# Altium schematic sheet ADC_AD9208.SchDoc
size A3; DocumentNumber: 1; SheetNumber: 1; SheetTotal: 5
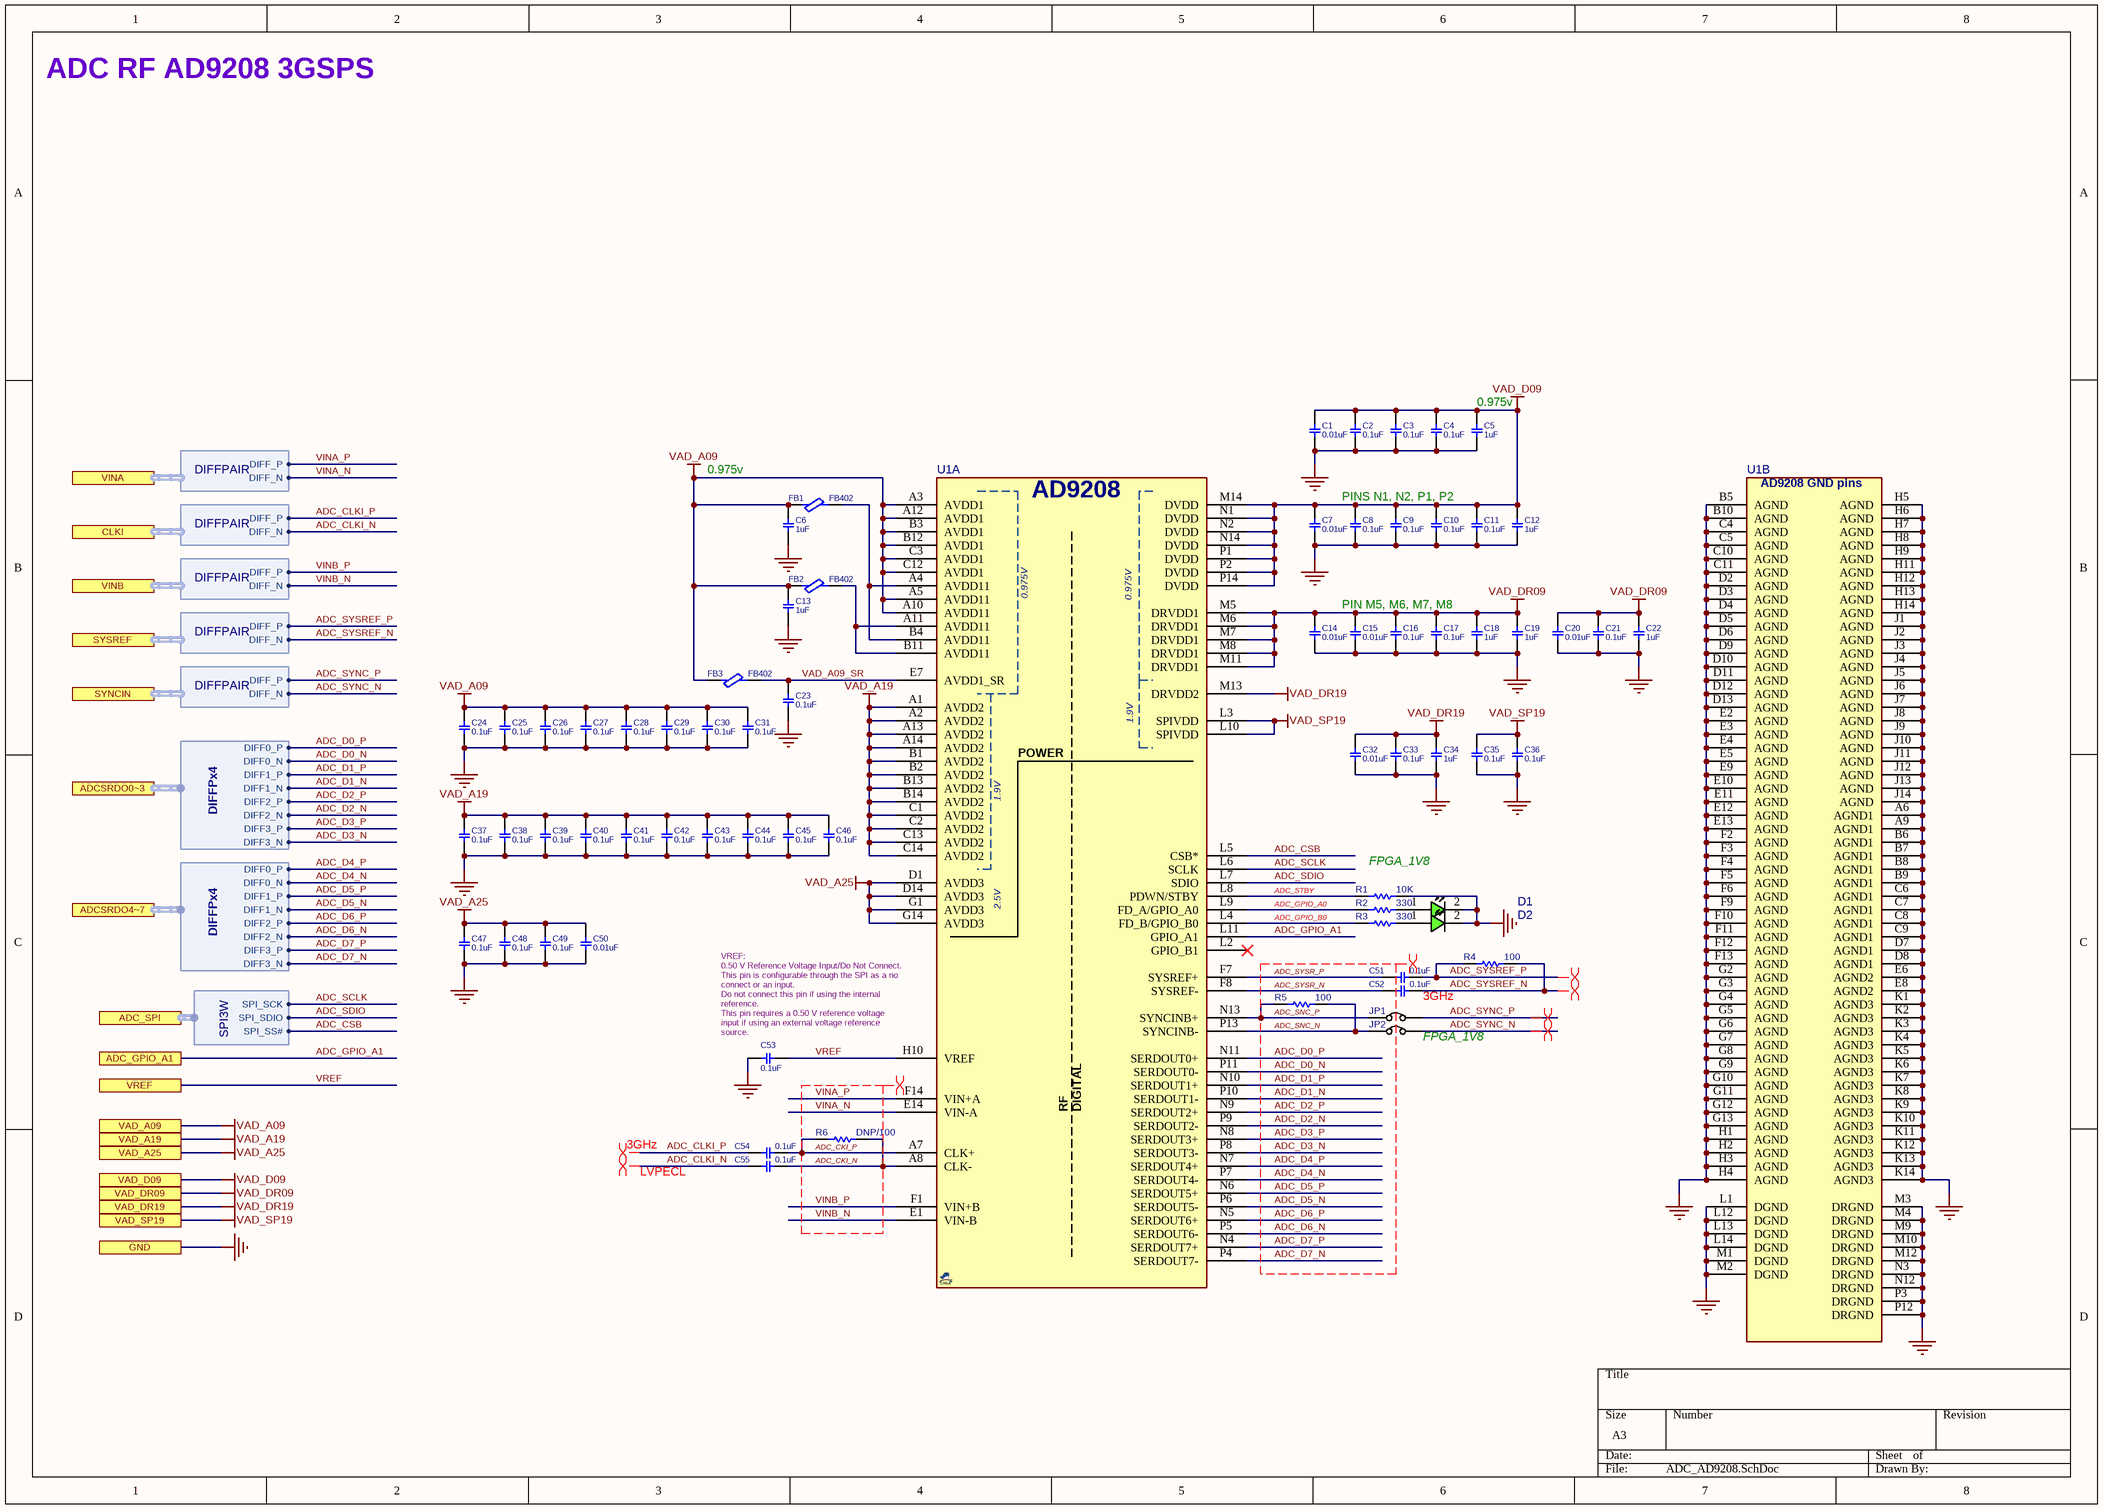
[diagram p0: ADC_AD9208.SchDoc]

## Parts
C1  0.01uF  [C0402]
C2  0.1uF  [C0402]
C3  0.1uF  [C0402]
C4  0.1uF  [C0402]
C5  1uF  [C0402]
C6  1uF  [C0402]
C7  0.01uF  [C0402]
C8  0.1uF  [C0402]
C9  0.1uF  [C0402]
C10  0.1uF  [C0402]
C11  0.1uF  [C0402]
C12  1uF  [C0402]
C13  1uF  [C0402]
C14  0.01uF  [C0402]
C15  0.01uF  [C0402]
C16  0.1uF  [C0402]
C17  0.1uF  [C0402]
C18  1uF  [C0402]
C19  1uF  [C0402]
C20  0.01uF  [C0402]
C21  0.1uF  [C0402]
C22  1uF  [C0402]
C23  0.1uF  [C0402]
C24  0.1uF  [C0402]
C25  0.1uF  [C0402]
C26  0.1uF  [C0402]
C27  0.1uF  [C0402]
C28  0.1uF  [C0402]
C29  0.1uF  [C0402]
C30  0.1uF  [C0402]
C31  0.1uF  [C0402]
C32  0.01uF  [C0402]
C33  0.1uF  [C0402]
C34  1uF  [C0402]
C35  0.1uF  [C0402]
C36  0.1uF  [C0402]
C37  0.1uF  [C0402]
C38  0.1uF  [C0402]
C39  0.1uF  [C0402]
C40  0.1uF  [C0402]
C41  0.1uF  [C0402]
C42  0.1uF  [C0402]
C43  0.1uF  [C0402]
C44  0.1uF  [C0402]
C45  0.1uF  [C0402]
C46  0.1uF  [C0402]
C47  0.1uF  [C0402]
C48  0.1uF  [C0402]
C49  0.1uF  [C0402]
C50  0.01uF  [C0402]
C51  0.1uF  [C0402]
C52  0.1uF  [C0402]
C53  0.1uF  [C0402]
C54  0.1uF  [C0402]
C55  0.1uF  [C0402]
D1  LED603GRN  [LED0603GRN]  (value not drawn)
D2  LED603GRN  [LED0603GRN]  (value not drawn)
FB1  FB402  [L0402]
FB2  FB402  [L0402]
FB3  FB402  [L0402]
JP1  JMPSOLDER  [JP_40X50]  (value not drawn)  (no BOM)
JP2  JMPSOLDER  [JP_40X50]  (value not drawn)  (no BOM)
R1  10K  [R0402]
R2  330  [R0402]
R3  330  [R0402]
R4  100  [R0402]
R5  100  [R0402]
R6  DNP/100  [R0402]
U1  AD9208  [BGA80_196_S12]  (value not drawn)  (parts A,B of 2)

## Ports
ADC_GPIO_A1, ADC_SPI (harness SPI3W), ADCSRDO0~3 (harness DIFFPx4), ADCSRDO4~7 (harness DIFFPx4), CLKI (harness DIFFPAIR), GND, SYNCIN (harness DIFFPAIR), SYSREF (harness DIFFPAIR), VAD_A09, VAD_A19, VAD_A25, VAD_D09, VAD_DR09, VAD_DR19, VAD_SP19, VINA (harness DIFFPAIR), VINB (harness DIFFPAIR), VREF

## Harnesses
DIFFPAIR: DIFF_N, DIFF_P
SPI3W: SPI_SCK, SPI_SDIO, SPI_SS#
DIFFPx4: DIFF0_P, DIFF1_N, DIFF1_P, DIFF2_N, DIFF2_P, DIFF3_N, DIFF3_P, DIFF0_N

## Nets
GND: C1.2 C2.2 C3.2 C4.2 C5.2 C6.2 C7.2 C8.2 C9.2 C10.2 C11.2 C12.2 C13.2 C14.2 C15.2 C16.2 C17.2 C18.2 C19.2 C20.2 C21.2 C22.2 C23.2 C24.2 C25.2 C26.2 C27.2 C28.2 C29.2 C30.2 C31.2 C32.2 C33.2 C34.2 C35.2 C36.2 C37.2 C38.2 C39.2 C40.2 C41.2 C42.2 C43.2 C44.2 C45.2 C46.2 C47.2 C48.2 C49.2 C50.2 C53.1 D1.2(CATHODE) D2.2(CATHODE) R1.2 U1.A6(AGND1) U1.A9(AGND1) U1.B5(AGND) U1.B6(AGND1) U1.B7(AGND1) U1.B8(AGND1) U1.B9(AGND1) U1.B10(AGND) U1.C4(AGND) U1.C5(AGND) U1.C6(AGND1) U1.C7(AGND1) U1.C8(AGND1) U1.C9(AGND1) U1.C10(AGND) U1.C11(AGND) U1.D2(AGND) U1.D3(AGND) U1.D4(AGND) U1.D5(AGND) U1.D6(AGND) U1.D7(AGND1) U1.D8(AGND1) U1.D9(AGND) U1.D10(AGND) U1.D11(AGND) U1.D12(AGND) U1.D13(AGND) U1.E2(AGND) U1.E3(AGND) U1.E4(AGND) U1.E5(AGND) U1.E6(AGND2) U1.E8(AGND2) U1.E9(AGND) U1.E10(AGND) U1.E11(AGND) U1.E12(AGND) U1.E13(AGND) U1.F2(AGND) U1.F3(AGND) U1.F4(AGND) U1.F5(AGND) U1.F6(AGND) U1.F9(AGND) U1.F10(AGND) U1.F11(AGND) U1.F12(AGND) U1.F13(AGND) U1.G2(AGND) U1.G3(AGND) U1.G4(AGND) U1.G5(AGND) U1.G6(AGND) U1.G7(AGND) U1.G8(AGND) U1.G9(AGND) U1.G10(AGND) U1.G11(AGND) U1.G12(AGND) U1.G13(AGND) U1.H1(AGND) U1.H2(AGND) U1.H3(AGND) U1.H4(AGND) U1.H5(AGND) U1.H6(AGND) U1.H7(AGND) U1.H8(AGND) U1.H9(AGND) U1.H11(AGND) U1.H12(AGND) U1.H13(AGND) U1.H14(AGND) U1.J1(AGND) U1.J2(AGND) U1.J3(AGND) U1.J4(AGND) U1.J5(AGND) U1.J6(AGND) U1.J7(AGND) U1.J8(AGND) U1.J9(AGND) U1.J10(AGND) U1.J11(AGND) U1.J12(AGND) U1.J13(AGND) U1.J14(AGND) U1.K1(AGND3) U1.K2(AGND3) U1.K3(AGND3) U1.K4(AGND3) U1.K5(AGND3) U1.K6(AGND3) U1.K7(AGND3) U1.K8(AGND3) U1.K9(AGND3) U1.K10(AGND3) U1.K11(AGND3) U1.K12(AGND3) U1.K13(AGND3) U1.K14(AGND3) U1.L1(DGND) U1.L12(DGND) U1.L13(DGND) U1.L14(DGND) U1.M1(DGND) U1.M2(DGND) U1.M3(DRGND) U1.M4(DRGND) U1.M9(DRGND) U1.M10(DRGND) U1.M12(DRGND) U1.N3(DRGND) U1.N12(DRGND) U1.P3(DRGND) U1.P12(DRGND) ; port GND
VAD_A09: C6.1 C13.1 C24.1 C25.1 C26.1 C27.1 C28.1 C29.1 C30.1 C31.1 FB1.1 FB2.1 FB3.1 U1.A3(AVDD1) U1.A5(AVDD11) U1.A10(AVDD11) U1.A12(AVDD1) U1.B3(AVDD1) U1.B12(AVDD1) U1.C3(AVDD1) U1.C12(AVDD1) ; port VAD_A09
VAD_A19: C37.1 C38.1 C39.1 C40.1 C41.1 C42.1 C43.1 C44.1 C45.1 C46.1 U1.A1(AVDD2) U1.A2(AVDD2) U1.A13(AVDD2) U1.A14(AVDD2) U1.B1(AVDD2) U1.B2(AVDD2) U1.B13(AVDD2) U1.B14(AVDD2) U1.C1(AVDD2) U1.C2(AVDD2) U1.C13(AVDD2) U1.C14(AVDD2) ; port VAD_A19
VAD_A25: C47.1 C48.1 C49.1 C50.1 U1.D1(AVDD3) U1.D14(AVDD3) U1.G1(AVDD3) U1.G14(AVDD3) ; port VAD_A25
VAD_D09: C1.1 C2.1 C3.1 C4.1 C5.1 C7.1 C8.1 C9.1 C10.1 C11.1 C12.1 U1.M14(DVDD) U1.N1(DVDD) U1.N2(DVDD) U1.N14(DVDD) U1.P1(DVDD) U1.P2(DVDD) U1.P14(DVDD) ; port VAD_D09
VAD_DR09: C14.1 C15.1 C16.1 C17.1 C18.1 C19.1 C20.1 C21.1 C22.1 U1.M5(DRVDD1) U1.M6(DRVDD1) U1.M7(DRVDD1) U1.M8(DRVDD1) U1.M11(DRVDD1) ; port VAD_DR09
VAD_DR19: C32.1 C33.1 C34.1 U1.M13(DRVDD2) ; port VAD_DR19
VAD_SP19: C35.1 C36.1 U1.L3(SPIVDD) U1.L10(SPIVDD) ; port VAD_SP19
ADC_CKI_N: C55.2 R6.2 U1.A8(CLK-)
ADC_CKI_P: C54.2 R6.1 U1.A7(CLK+)
ADC_CLKI_N: C55.1 ; port CLKI.DIFF_N
ADC_CLKI_P: C54.1 ; port CLKI.DIFF_P
ADC_CSB: U1.L5(CSB*) ; port ADC_SPI.SPI_SS#
ADC_D0_N: U1.P11(SERDOUT0-) ; port ADCSRDO0~3.DIFF0_N
ADC_D0_P: U1.N11(SERDOUT0+) ; port ADCSRDO0~3.DIFF0_P
ADC_D1_N: U1.P10(SERDOUT1-) ; port ADCSRDO0~3.DIFF1_N
ADC_D1_P: U1.N10(SERDOUT1+) ; port ADCSRDO0~3.DIFF1_P
ADC_D2_N: U1.P9(SERDOUT2-) ; port ADCSRDO0~3.DIFF2_N
ADC_D2_P: U1.N9(SERDOUT2+) ; port ADCSRDO0~3.DIFF2_P
ADC_D3_N: U1.P8(SERDOUT3-) ; port ADCSRDO0~3.DIFF3_N
ADC_D3_P: U1.N8(SERDOUT3+) ; port ADCSRDO0~3.DIFF3_P
ADC_D4_N: U1.P7(SERDOUT4-) ; port ADCSRDO4~7.DIFF0_N
ADC_D4_P: U1.N7(SERDOUT4+) ; port ADCSRDO4~7.DIFF0_P
ADC_D5_N: U1.P6(SERDOUT5-) ; port ADCSRDO4~7.DIFF1_N
ADC_D5_P: U1.N6(SERDOUT5+) ; port ADCSRDO4~7.DIFF1_P
ADC_D6_N: U1.P5(SERDOUT6-) ; port ADCSRDO4~7.DIFF2_N
ADC_D6_P: U1.N5(SERDOUT6+) ; port ADCSRDO4~7.DIFF2_P
ADC_D7_N: U1.P4(SERDOUT7-) ; port ADCSRDO4~7.DIFF3_N
ADC_D7_P: U1.N4(SERDOUT7+) ; port ADCSRDO4~7.DIFF3_P
ADC_GPIO_A0: R2.1 U1.L9(FD_A/GPIO_A0)
ADC_GPIO_A1: U1.L11(GPIO_A1) ; port ADC_GPIO_A1
ADC_GPIO_B0: R3.1 U1.L4(FD_B/GPIO_B0)
ADC_SCLK: U1.L6(SCLK) ; port ADC_SPI.SPI_SCK
ADC_SDIO: U1.L7(SDIO) ; port ADC_SPI.SPI_SDIO
ADC_SNC_N: JP2.1 R5.2 U1.P13(SYNCINB-)
ADC_SNC_P: JP1.1 R5.1 U1.N13(SYNCINB+)
ADC_STBY: R1.1 U1.L8(PDWN/STBY)
ADC_SYNC_N: JP2.2 ; port SYNCIN.DIFF_N
ADC_SYNC_P: JP1.2 ; port SYNCIN.DIFF_P
ADC_SYSR_N: C52.1 U1.F8(SYSREF-)
ADC_SYSR_P: C51.1 U1.F7(SYSREF+)
ADC_SYSREF_N: C52.2 R4.2 ; port SYSREF.DIFF_N
ADC_SYSREF_P: C51.2 R4.1 ; port SYSREF.DIFF_P
VAD_A09_SR: C23.1 FB3.2 U1.E7(AVDD1_SR)
VINA_N: U1.E14(VIN-A) ; port VINA.DIFF_N
VINA_P: U1.F14(VIN+A) ; port VINA.DIFF_P
VINB_N: U1.E1(VIN-B) ; port VINB.DIFF_N
VINB_P: U1.F1(VIN+B) ; port VINB.DIFF_P
VREF: C53.2 U1.H10(VREF) ; port VREF
NetD1_1: D1.1(ANODE) R2.2
NetD2_1: D2.1(ANODE) R3.2
NetFB1_2: FB1.2 U1.A4(AVDD11) U1.B4(AVDD11)
NetFB2_2: FB2.2 U1.A11(AVDD11) U1.B11(AVDD11)

Not connected (* = marked no-connect by the designer): U1 L2(GPIO_B1)*

## Layout directives
differential pair: ADC_CKI_N, ADC_CKI_P, ADC_CLKI_N, ADC_CLKI_P, ADC_D0_N, ADC_D0_P, ADC_D1_N, ADC_D1_P, ADC_D2_N, ADC_D2_P, ADC_D3_N, ADC_D3_P, ADC_D4_N, ADC_D4_P, ADC_D5_N, ADC_D5_P, ADC_D6_N, ADC_D6_P, ADC_D7_N, ADC_D7_P, ADC_SNC_N, ADC_SNC_P, ADC_SYNC_N, ADC_SYNC_P, ADC_SYSR_N, ADC_SYSR_P, ADC_SYSREF_N, ADC_SYSREF_P, VINA_N, VINA_P, VINB_N, VINB_P

## Notes on the sheet
- ADC RF AD9208 3GSPS
- (near C5) 0.975v
- 0.975v
- PINS N1, N2, P1, P2
- PIN M5, M6, M7, M8
- FPGA_1V8
- (near C53) VREF:
  0.50 V Reference Voltage Input/Do Not Connect. This pin is configurable through the SPI as a no connect or an input.
  Do not connect this pin if using the internal
  reference.
  This pin requires a 0.50 V reference voltage
  input if using an external voltage reference source.
- 3GHz
- LVPECL
- (in symbol AD9208_BGA196, part A) 0.975V; 1.9V; POWER; 2.5V; RF; DIGITAL
- (in symbol AD9208_BGA196, part B) AD9208 GND pins

## Library data of the parts
C1 C5 C7 C12 C14 C15 C18-C20 C22 C32 C34 = CAP_SMD_MLCC: CAP, MLCC; MANF_P#: MANF_PART#; MANF: Murata; PARAM: -; PRICE: 100= 1$; PARAM2: -; ASSEMBLY: ASSEMBLY
  C1 C7 C14 C15 C20 C32: VALUE: 0.01uF
  C5 C12 C18 C19 C22 C34: VALUE: 1uF
C2-C4 C6 C8-C11 C13 C16 C17 C21 C23-C31 C33 C35-C55 = CAP_SMD_MLCC_100n50T: CAP, MLCC; PARAM: 50V; PARAM2: X5R, 10%; MANF_P#: -; MANF: -; DESC: -; ASSEMBLY: ASSEMBLY; PRICE: 100= 5$
  C2-C4 C8-C11 C16 C17 C21 C23-C31 C33 C35-C49 C51-C55: VALUE: 0.1uF
  C6 C13: VALUE: 1uF
  C50: VALUE: 0.01uF
D1 D2 = LED_SMD_0603_GRN: LED, SMD, 0603, GREEN; PARAM: 20mA; MANF: Kingbright; DESC: DESCRIPTION; MANF_P#: APT1608SGC; PARAM2: 2.2V; ASSEMBLY: ASSEMBLY; PRICE: 1: 0.14$, 100: 6.8$; VALUE: LED603GRN
FB1-FB3 = FBEAD_SMD_BLM15PD121: FERRITE_Bead, 0402, 0.5A, 200mOhm, 120@100MHz; MANF: MURATA; MANF_P#: BLM15AG121SN1D; PARAM: 120@100MHz; PARAM2: 0.5A, 200mOhm; VALUE: FB402
JP1 JP2 = JUMPER_SOLDER: JUMPER,  solder; MANF: MANF; MANF_P#: MANF_P#; VALUE: JMPSOLDER
R1-R6 = Res: Resistor
  R1: Value: 10K
  R2 R3: Value: 330
  R4 R5: Value: 100
  R6: Value: DNP/100
U1 = AD9208_BGA196: ADC, 14-Bit, 3Gsps, Dual, JESD204B; MANF: Analog Devices; PARAM: -40~85°C; DESC: DESCRIPTION; MANF_P#: AD9208BBPZ-3000; PARAM2: 0.975V, 1.9V, 2.5V; ASSEMBLY: ASSEMBLY; PRICE: 1600$; VALUE: AD9208; PACKAGE: BGA-196